# EAGLE schematic i2c_adc_avr_inline_soic (EAGLE 6.4)
DATABASE: /home/mes/eagle/PARTSDB.txt
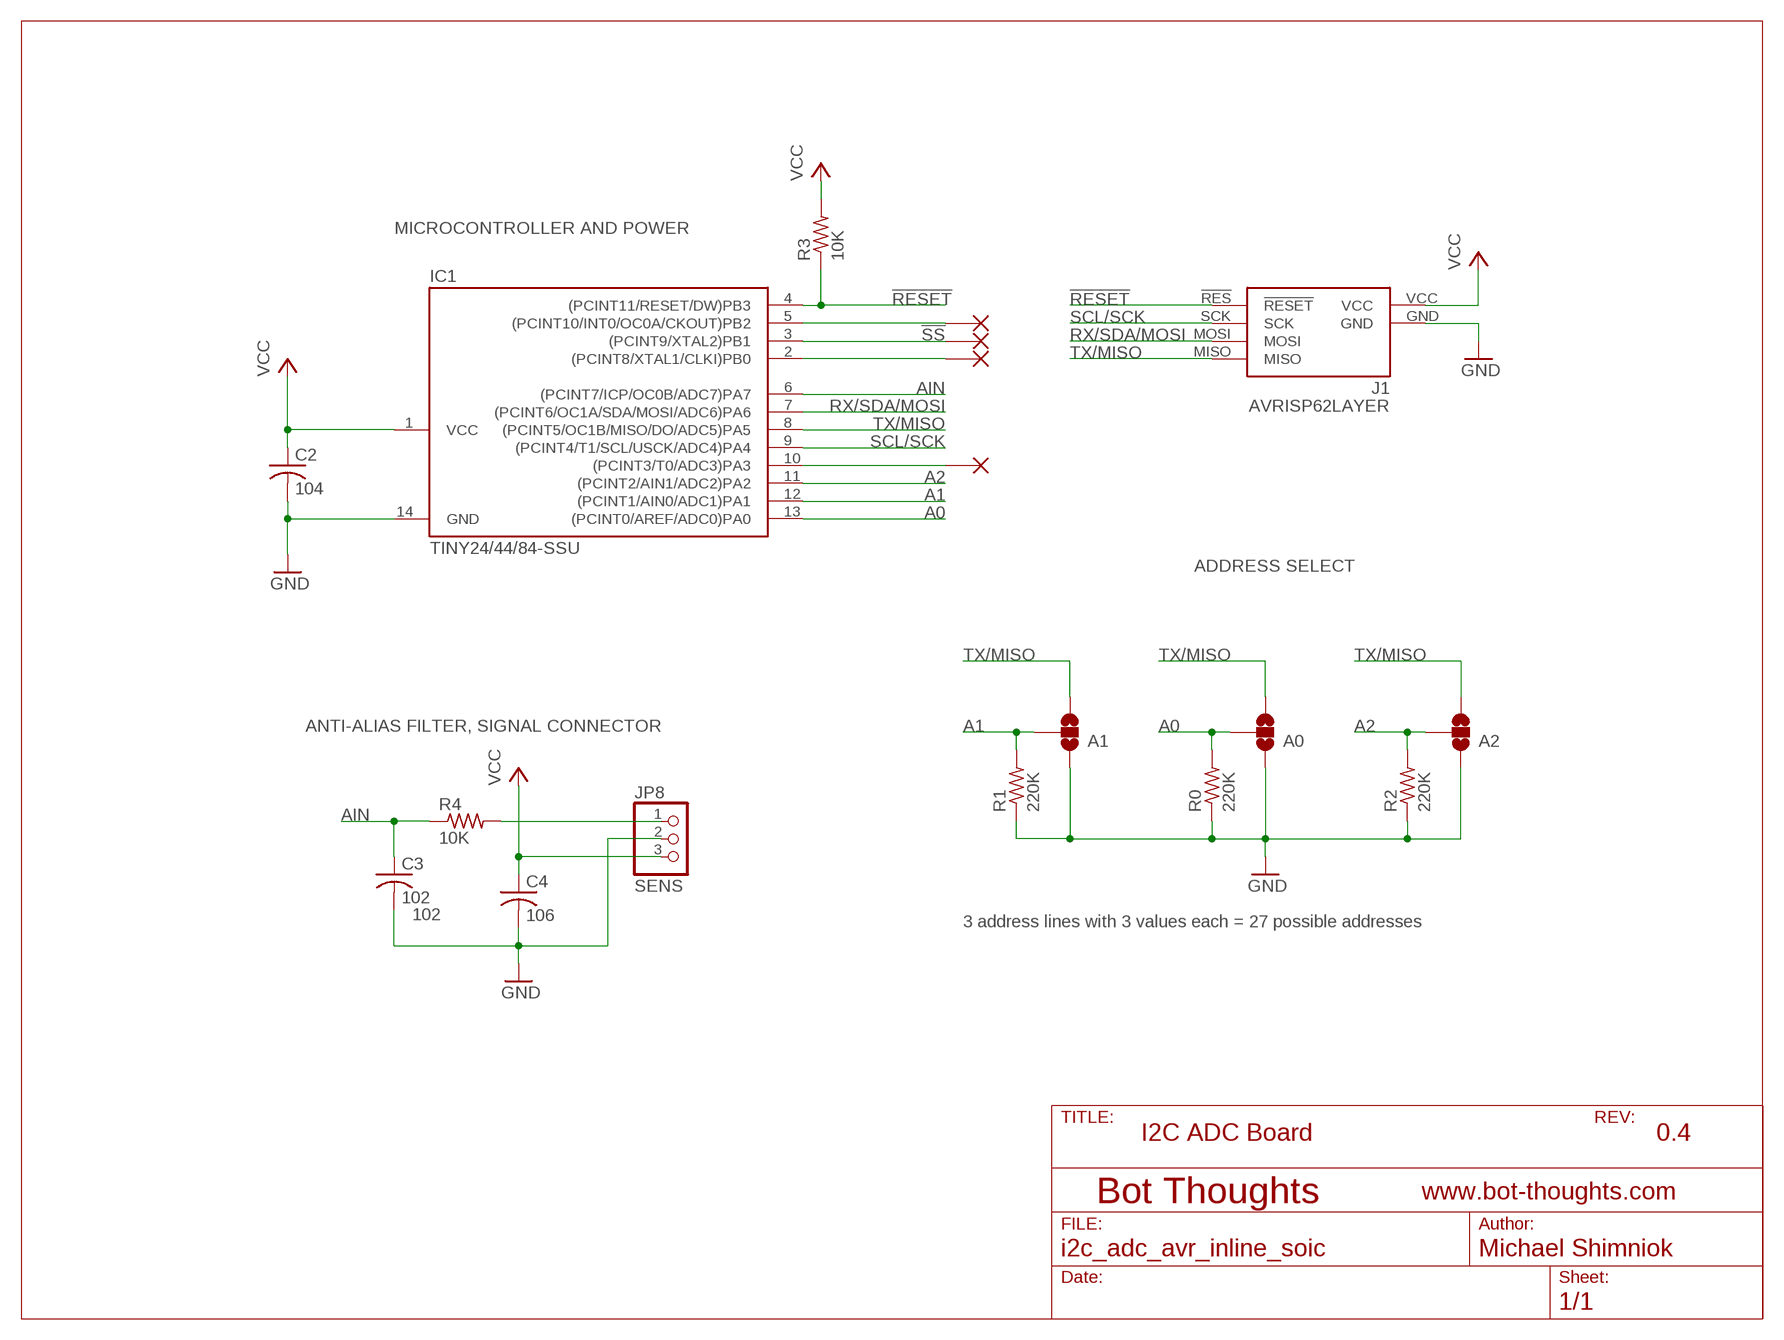
[diagram p0: schematic, sheet 1]

## Parts
A0  SOLDERJUMPER_2WAYS  [SJ_3]
A1  SOLDERJUMPER_2WAYS  [SJ_3]
A2  SOLDERJUMPER_2WAYS  [SJ_3]
C2  104  C-USC0603  [C0603]
C3  102  C-USC0603  [C0603]
C4  106  C-USC0603  [C0603]
IC1  TINY24/44/84-SSU  [SOIC14]
J1  AVRISP62LAYER  [2X3_2LAYER]
JP8  SENS  PINHD-1X03_2.54-S  [1X03-S]
R0  220K  R-US_R0603  [R0603]
R1  220K  R-US_R0603  [R0603]
R2  220K  R-US_R0603  [R0603]
R3  10K  R-US_R0603  [R0603]
R4  10K  R-US_R0603  [R0603]
X1  PB2  PINPADSMD0.07X0.15  [PAD0.07X0.15]
X2  !SS  PINPADSMD0.07X0.15  [PAD0.07X0.15]
X3  PB0  PINPADSMD0.07X0.15  [PAD0.07X0.15]
X4  PA3  PINPADSMD0.07X0.15  [PAD0.07X0.15]

## Nets
!RESET: IC1.4((PCINT11/RESET/DW)PB3) J1.!RES(!RESET) R3.1
!SS: IC1.3((PCINT9/XTAL2)PB1) X2.P$1
A0: A0.2 IC1.13((PCINT0/AREF/ADC0)PA0) R0.2
A1: A1.2 IC1.12((PCINT1/AIN0/ADC1)PA1) R1.2
A2: A2.2 IC1.11((PCINT2/AIN1/ADC2)PA2) R2.2
AIN: C3.1 IC1.6((PCINT7/ICP/OC0B/ADC7)PA7) R4.1
GND: A0.1 A1.1 A2.1 C2.2 C3.2 C4.2 IC1.14(GND) J1.GND JP8.2 R0.1 R1.1 R2.1
N$1: JP8.1 R4.2
N$5: IC1.10((PCINT3/T0/ADC3)PA3) X4.P$1
N$6: IC1.2((PCINT8/XTAL1/CLKI)PB0) X3.P$1
N$7: IC1.5((PCINT10/INT0/OC0A/CKOUT)PB2) X1.P$1
RX/SDA/MOSI: IC1.7((PCINT6/OC1A/SDA/MOSI/ADC6)PA6) J1.MOSI
SCL/SCK: IC1.9((PCINT4/T1/SCL/USCK/ADC4)PA4) J1.SCK
TX/MISO: A0.3 A1.3 A2.3 IC1.8((PCINT5/OC1B/MISO/DO/ADC5)PA5) J1.MISO
VCC: C2.1 C4.1 IC1.1(VCC) J1.VCC JP8.3 R3.2

## Notes on the sheet
- MICROCONTROLLER AND POWER
- ADDRESS SELECT
- ANTI-ALIAS FILTER, SIGNAL CONNECTOR
- 3 address lines with 3 values each = 27 possible addresses
- I2C ADC Board | 0.4

## Library data of the parts
A0 A1 A2 = SparkFun:SOLDERJUMPER_2WAY: Solder Jumper 2 way solder jumper
C2 = rcl:C-US: CAPACITOR, American symbol; PARTNO: C1608X7R1E104K080AA
C3 = rcl:C-US: CAPACITOR, American symbol; CODE: 102; PARTNO: CL10B102KB8SFNC
C4 = rcl:C-US: CAPACITOR, American symbol; PARTNO: CL10A106MP8NNNC
IC1 = avr-7:TINY24/44/84
J1 = mes_avr:AVRISP6: 6-pin dual-row connector for Atmel AVRISP programmer interface
JP8 = pinhead-2:PINHD-1X03: PIN HEADER
R0 R1 R2 = rcl:R-US_: RESISTOR, American symbol; PARTNO: RC1608J224CS
R3 R4 = rcl:R-US_: RESISTOR, American symbol; PARTNO: 1622829-1
X1-X4 = mes_electromech:PINPAD: PIN PAD (PINPAD) Generic pin pad connector